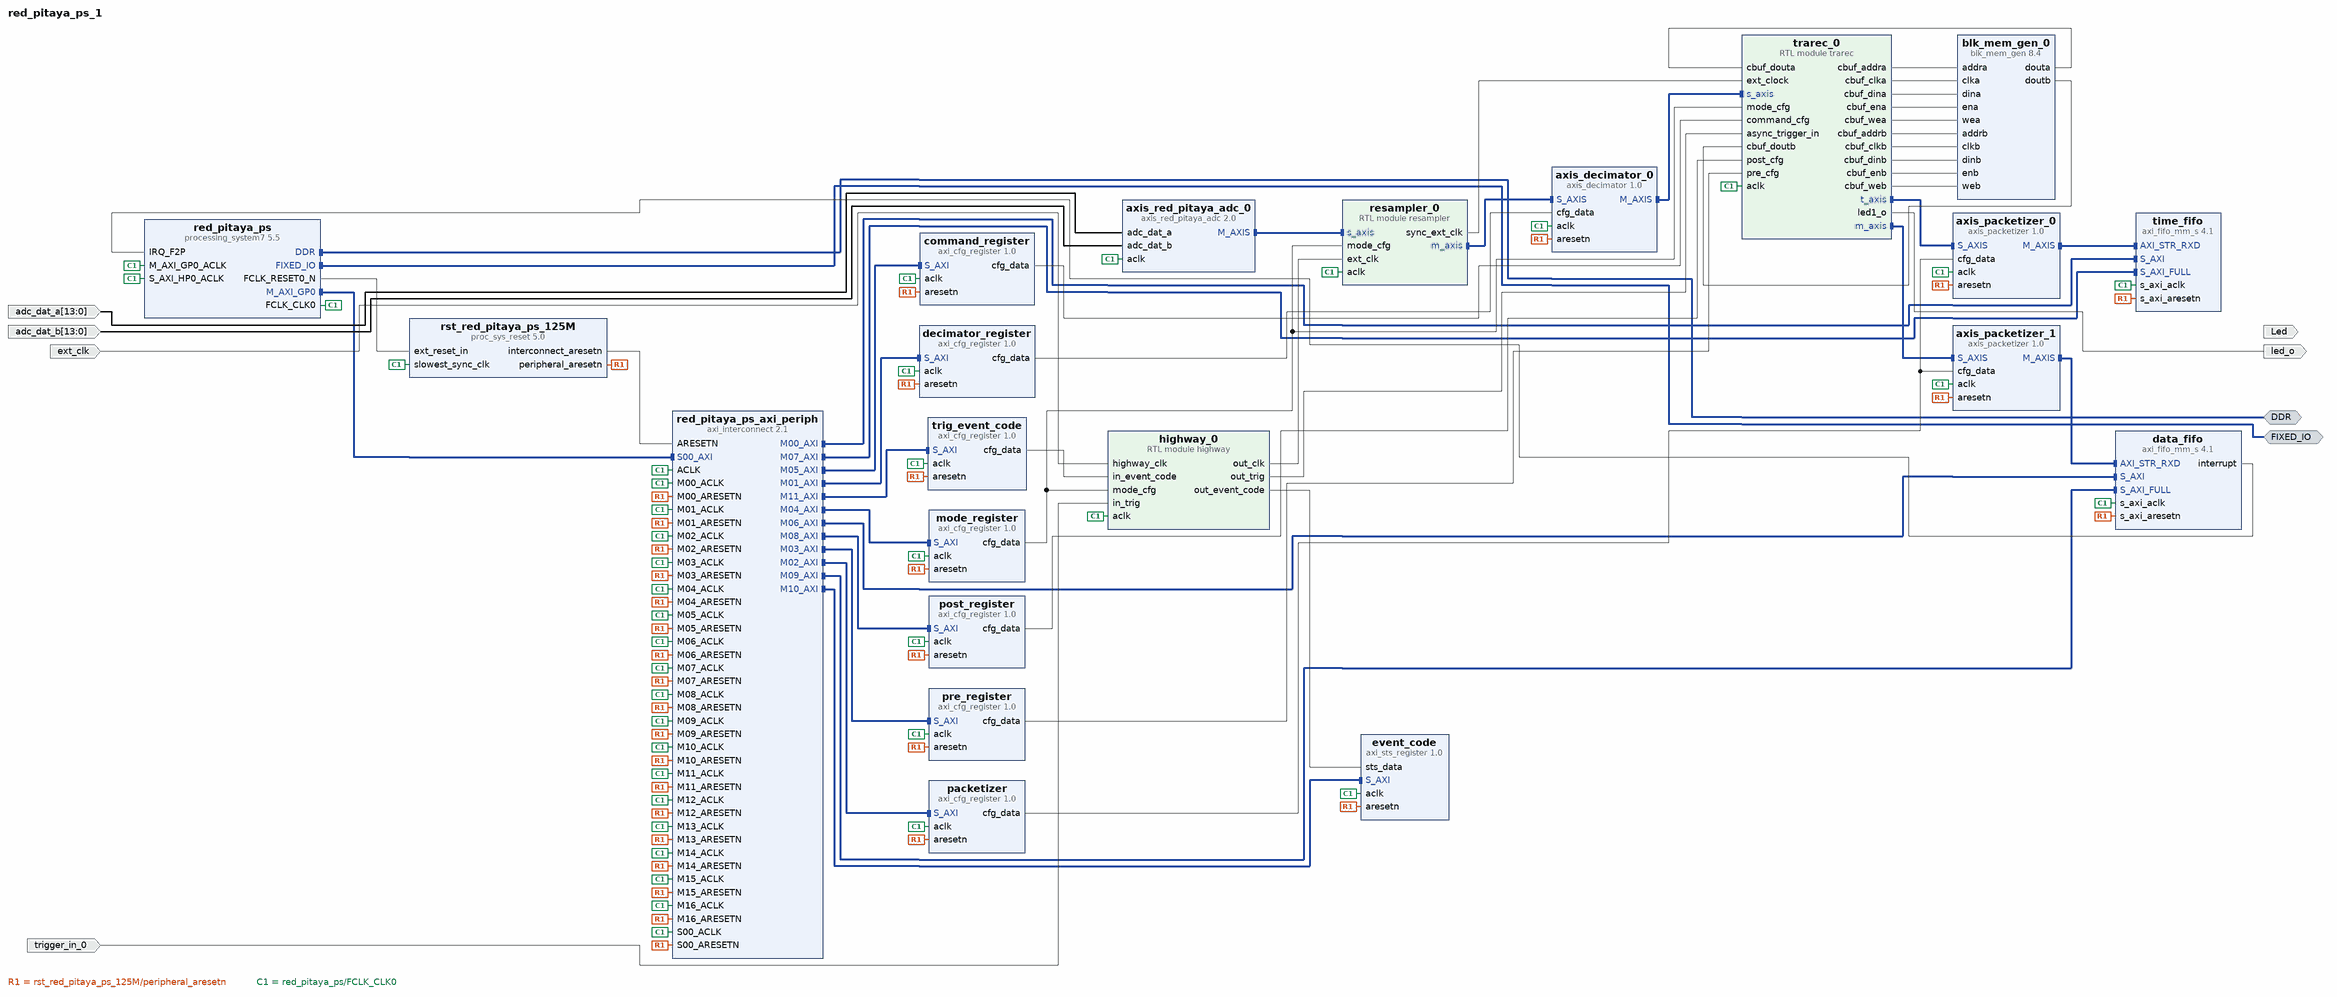
[diagram p0: block diagram of the top level]
# Vivado block design red_pitaya_ps_1, xc7z010clg400-1, Vivado 2017.4
create_bd_design red_pitaya_ps_1

create_bd_intf_port -mode Master -vlnv xilinx.com:interface:ddrx_rtl:1.0 DDR
create_bd_intf_port -mode Master -vlnv xilinx.com:display_processing_system7:fixedio_rtl:1.0 FIXED_IO
create_bd_port -dir I -from 13 -to 0 adc_dat_a
create_bd_port -dir I -from 13 -to 0 adc_dat_b
create_bd_port -dir O led_o
create_bd_port -dir O Led
create_bd_port -dir I -type clk ext_clk
set_property -dict {CONFIG.FREQ_HZ 125000000} [get_bd_ports ext_clk]
create_bd_port -dir I trigger_in_0

create_bd_cell -type ip -vlnv xilinx.com:ip:processing_system7:5.5 red_pitaya_ps
set_property -dict [list \
  CONFIG.PCW_QSPI_PERIPHERAL_FREQMHZ 125 \
  CONFIG.PCW_SDIO_PERIPHERAL_FREQMHZ 100 \
  CONFIG.PCW_UART_PERIPHERAL_FREQMHZ 100 \
  CONFIG.PCW_I2C_PERIPHERAL_FREQMHZ 111.111115 \
  CONFIG.PCW_FPGA0_PERIPHERAL_FREQMHZ 125 \
  CONFIG.PCW_FPGA1_PERIPHERAL_FREQMHZ 250 \
  CONFIG.PCW_FPGA3_PERIPHERAL_FREQMHZ 200 \
  CONFIG.PCW_USE_S_AXI_HP0 1 \
  CONFIG.PCW_USE_FABRIC_INTERRUPT 1 \
  CONFIG.PCW_S_AXI_HP0_DATA_WIDTH 32 \
  CONFIG.PCW_IRQ_F2P_INTR 1 \
  CONFIG.PCW_PRESET_BANK1_VOLTAGE {LVCMOS 2.5V} \
  CONFIG.PCW_UIPARAM_DDR_BUS_WIDTH {16 Bit} \
  CONFIG.PCW_UIPARAM_DDR_PARTNO {MT41J256M16 RE-125} \
  CONFIG.PCW_QSPI_PERIPHERAL_ENABLE 1 \
  CONFIG.PCW_QSPI_QSPI_IO {MIO 1 .. 6} \
  CONFIG.PCW_QSPI_GRP_SINGLE_SS_ENABLE 1 \
  CONFIG.PCW_QSPI_GRP_SINGLE_SS_IO {MIO 1 .. 6} \
  CONFIG.PCW_SINGLE_QSPI_DATA_MODE x4 \
  CONFIG.PCW_ENET0_PERIPHERAL_ENABLE 1 \
  CONFIG.PCW_ENET0_ENET0_IO {MIO 16 .. 27} \
  CONFIG.PCW_ENET0_GRP_MDIO_ENABLE 1 \
  CONFIG.PCW_ENET0_GRP_MDIO_IO {MIO 52 .. 53} \
  CONFIG.PCW_ENET_RESET_ENABLE 1 \
  CONFIG.PCW_ENET_RESET_SELECT {Share reset pin} \
  CONFIG.PCW_ENET0_RESET_ENABLE 0 \
  CONFIG.PCW_SD0_PERIPHERAL_ENABLE 1 \
  CONFIG.PCW_SD0_SD0_IO {MIO 40 .. 45} \
  CONFIG.PCW_SD0_GRP_CD_ENABLE 1 \
  CONFIG.PCW_SD0_GRP_CD_IO {MIO 46} \
  CONFIG.PCW_SD0_GRP_WP_ENABLE 1 \
  CONFIG.PCW_SD0_GRP_WP_IO {MIO 47} \
  CONFIG.PCW_UART0_PERIPHERAL_ENABLE 1 \
  CONFIG.PCW_UART0_UART0_IO {MIO 14 .. 15} \
  CONFIG.PCW_UART1_PERIPHERAL_ENABLE 1 \
  CONFIG.PCW_UART1_UART1_IO {MIO 8 .. 9} \
  CONFIG.PCW_SPI1_PERIPHERAL_ENABLE 1 \
  CONFIG.PCW_SPI1_SPI1_IO {MIO 10 .. 15} \
  CONFIG.PCW_USB0_PERIPHERAL_ENABLE 1 \
  CONFIG.PCW_USB0_USB0_IO {MIO 28 .. 39} \
  CONFIG.PCW_USB_RESET_ENABLE 1 \
  CONFIG.PCW_USB_RESET_SELECT {Share reset pin} \
  CONFIG.PCW_USB0_RESET_ENABLE 1 \
  CONFIG.PCW_USB0_RESET_IO {MIO 48} \
  CONFIG.PCW_I2C0_PERIPHERAL_ENABLE 1 \
  CONFIG.PCW_I2C0_I2C0_IO {MIO 50 .. 51} \
  CONFIG.PCW_I2C0_GRP_INT_ENABLE 0 \
  CONFIG.PCW_I2C_RESET_ENABLE 1 \
  CONFIG.PCW_I2C_RESET_SELECT {Share reset pin} \
  CONFIG.PCW_GPIO_MIO_GPIO_ENABLE 1 \
  CONFIG.PCW_GPIO_MIO_GPIO_IO MIO \
] [get_bd_cells red_pitaya_ps]
# 218 more settings of red_pitaya_ps are not shown: defaults, MIO pin electricals, DDR timing, and values the tool derives
create_bd_cell -type ip -vlnv xilinx.com:ip:axi_interconnect:2.1 red_pitaya_ps_axi_periph
set_property -dict {CONFIG.NUM_MI 17} [get_bd_cells red_pitaya_ps_axi_periph]
create_bd_cell -type ip -vlnv pavel-demin:user:axis_red_pitaya_adc:2.0 axis_red_pitaya_adc_0
create_bd_cell -type ip -vlnv pavel-demin:user:axis_decimator:1.0 axis_decimator_0
create_bd_cell -type ip -vlnv xilinx.com:ip:blk_mem_gen:8.4 blk_mem_gen_0
set_property -dict [list \
  CONFIG.Memory_Type True_Dual_Port_RAM \
  CONFIG.Enable_32bit_Address false \
  CONFIG.Use_Byte_Write_Enable false \
  CONFIG.Algorithm Minimum_Area \
  CONFIG.Assume_Synchronous_Clk false \
  CONFIG.Write_Width_A 32 \
  CONFIG.Write_Depth_A 16384 \
  CONFIG.Read_Width_A 32 \
  CONFIG.Write_Width_B 32 \
  CONFIG.Read_Width_B 32 \
  CONFIG.Enable_B Use_ENB_Pin \
  CONFIG.Register_PortA_Output_of_Memory_Primitives true \
  CONFIG.Register_PortB_Output_of_Memory_Primitives true \
  CONFIG.Use_RSTA_Pin false \
  CONFIG.Use_RSTB_Pin false \
  CONFIG.Port_B_Clock 100 \
  CONFIG.Port_B_Write_Rate 50 \
  CONFIG.Port_B_Enable_Rate 100 \
  CONFIG.Disable_Collision_Warnings false \
  CONFIG.use_bram_block Stand_Alone \
] [get_bd_cells blk_mem_gen_0]
create_bd_cell -type ip -vlnv pavel-demin:user:axi_cfg_register:1.0 decimator_register
set_property -dict {CONFIG.CFG_DATA_WIDTH 32} [get_bd_cells decimator_register]
create_bd_cell -type ip -vlnv pavel-demin:user:axis_packetizer:1.0 axis_packetizer_0
set_property -dict {CONFIG.CONTINUOUS TRUE} [get_bd_cells axis_packetizer_0]
create_bd_cell -type ip -vlnv pavel-demin:user:axi_cfg_register:1.0 packetizer
set_property -dict {CONFIG.CFG_DATA_WIDTH 32} [get_bd_cells packetizer]
create_bd_cell -type ip -vlnv pavel-demin:user:axi_cfg_register:1.0 pre_register
set_property -dict {CONFIG.CFG_DATA_WIDTH 32} [get_bd_cells pre_register]
create_bd_cell -type ip -vlnv pavel-demin:user:axi_cfg_register:1.0 mode_register
set_property -dict {CONFIG.CFG_DATA_WIDTH 32} [get_bd_cells mode_register]
create_bd_cell -type ip -vlnv pavel-demin:user:axi_cfg_register:1.0 command_register
set_property -dict {CONFIG.CFG_DATA_WIDTH 32} [get_bd_cells command_register]
create_bd_cell -type ip -vlnv xilinx.com:ip:axi_fifo_mm_s:4.1 time_fifo
set_property -dict [list \
  CONFIG.C_DATA_INTERFACE_TYPE 1 \
  CONFIG.C_USE_TX_DATA 0 \
  CONFIG.C_USE_RX_DATA 1 \
  CONFIG.C_USE_TX_CTRL 0 \
] [get_bd_cells time_fifo]
create_bd_cell -type ip -vlnv xilinx.com:ip:proc_sys_reset:5.0 rst_red_pitaya_ps_125M
create_bd_cell -type ip -vlnv pavel-demin:user:axi_cfg_register:1.0 post_register
set_property -dict {CONFIG.CFG_DATA_WIDTH 32} [get_bd_cells post_register]
create_bd_cell -type ip -vlnv xilinx.com:ip:axi_fifo_mm_s:4.1 data_fifo
set_property -dict [list \
  CONFIG.C_DATA_INTERFACE_TYPE 1 \
  CONFIG.C_RX_FIFO_PE_THRESHOLD 2 \
  CONFIG.C_RX_FIFO_PF_THRESHOLD 507 \
  CONFIG.C_RX_FIFO_DEPTH 32768 \
  CONFIG.C_S_AXI4_DATA_WIDTH 32 \
  CONFIG.C_AXIS_TUSER_WIDTH 4 \
  CONFIG.C_USE_TX_DATA 0 \
  CONFIG.C_USE_RX_DATA 1 \
  CONFIG.C_USE_TX_CTRL 0 \
] [get_bd_cells data_fifo]
create_bd_cell -type ip -vlnv pavel-demin:user:axis_packetizer:1.0 axis_packetizer_1
set_property -dict {CONFIG.CONTINUOUS TRUE} [get_bd_cells axis_packetizer_1]
create_bd_cell -type ip -vlnv pavel-demin:user:axi_sts_register:1.0 event_code
set_property -dict {CONFIG.STS_DATA_WIDTH 32} [get_bd_cells event_code]
create_bd_cell -type module -reference resampler resampler_0
create_bd_cell -type ip -vlnv pavel-demin:user:axi_cfg_register:1.0 trig_event_code
create_bd_cell -type module -reference trarec trarec_0
create_bd_cell -type module -reference highway highway_0

# ---- connections ----

connect_bd_intf_net [get_bd_intf_pins red_pitaya_ps/M_AXI_GP0] [get_bd_intf_pins red_pitaya_ps_axi_periph/S00_AXI]
connect_bd_intf_net [get_bd_intf_pins red_pitaya_ps_axi_periph/M01_AXI] [get_bd_intf_pins decimator_register/S_AXI]
connect_bd_intf_net [get_bd_intf_pins red_pitaya_ps_axi_periph/M02_AXI] [get_bd_intf_pins packetizer/S_AXI]
connect_bd_intf_net [get_bd_intf_pins red_pitaya_ps_axi_periph/M03_AXI] [get_bd_intf_pins pre_register/S_AXI]
connect_bd_intf_net [get_bd_intf_pins red_pitaya_ps_axi_periph/M04_AXI] [get_bd_intf_pins mode_register/S_AXI]
connect_bd_intf_net [get_bd_intf_pins red_pitaya_ps_axi_periph/M05_AXI] [get_bd_intf_pins command_register/S_AXI]
connect_bd_intf_net [get_bd_intf_pins red_pitaya_ps_axi_periph/M00_AXI] [get_bd_intf_pins time_fifo/S_AXI]
connect_bd_intf_net [get_bd_intf_pins axis_packetizer_0/M_AXIS] [get_bd_intf_pins time_fifo/AXI_STR_RXD]
connect_bd_intf_net [get_bd_intf_pins red_pitaya_ps_axi_periph/M07_AXI] [get_bd_intf_pins time_fifo/S_AXI_FULL]
connect_bd_intf_net [get_bd_intf_pins trarec_0/t_axis] [get_bd_intf_pins axis_packetizer_0/S_AXIS]
connect_bd_intf_net [get_bd_intf_pins resampler_0/s_axis] [get_bd_intf_pins axis_red_pitaya_adc_0/M_AXIS]
connect_bd_intf_net [get_bd_intf_pins resampler_0/m_axis] [get_bd_intf_pins axis_decimator_0/S_AXIS]
connect_bd_intf_net [get_bd_intf_pins red_pitaya_ps_axi_periph/M08_AXI] [get_bd_intf_pins post_register/S_AXI]
connect_bd_intf_net [get_bd_intf_pins red_pitaya_ps_axi_periph/M06_AXI] [get_bd_intf_pins data_fifo/S_AXI]
connect_bd_intf_net [get_bd_intf_pins red_pitaya_ps_axi_periph/M09_AXI] [get_bd_intf_pins data_fifo/S_AXI_FULL]
connect_bd_intf_net [get_bd_intf_pins trarec_0/m_axis] [get_bd_intf_pins axis_packetizer_1/S_AXIS]
connect_bd_intf_net [get_bd_intf_pins axis_packetizer_1/M_AXIS] [get_bd_intf_pins data_fifo/AXI_STR_RXD]
connect_bd_intf_net [get_bd_intf_pins axis_decimator_0/M_AXIS] [get_bd_intf_pins trarec_0/s_axis]
connect_bd_intf_net [get_bd_intf_pins red_pitaya_ps_axi_periph/M10_AXI] [get_bd_intf_pins event_code/S_AXI]
connect_bd_intf_net [get_bd_intf_pins red_pitaya_ps_axi_periph/M11_AXI] [get_bd_intf_pins trig_event_code/S_AXI]
connect_bd_intf_net [get_bd_intf_ports DDR] [get_bd_intf_pins red_pitaya_ps/DDR]
connect_bd_intf_net [get_bd_intf_ports FIXED_IO] [get_bd_intf_pins red_pitaya_ps/FIXED_IO]
connect_bd_net [get_bd_pins rst_red_pitaya_ps_125M/peripheral_aresetn] \
  [get_bd_pins axis_decimator_0/aresetn] [get_bd_pins decimator_register/aresetn] [get_bd_pins axis_packetizer_0/aresetn] \
  [get_bd_pins packetizer/aresetn] [get_bd_pins mode_register/aresetn] [get_bd_pins command_register/aresetn] \
  [get_bd_pins time_fifo/s_axi_aresetn] [get_bd_pins pre_register/aresetn] [get_bd_pins post_register/aresetn] \
  [get_bd_pins data_fifo/s_axi_aresetn] [get_bd_pins axis_packetizer_1/aresetn] [get_bd_pins event_code/aresetn] \
  [get_bd_pins trig_event_code/aresetn] [get_bd_pins red_pitaya_ps_axi_periph/S00_ARESETN] \
  [get_bd_pins red_pitaya_ps_axi_periph/M00_ARESETN] [get_bd_pins red_pitaya_ps_axi_periph/M01_ARESETN] \
  [get_bd_pins red_pitaya_ps_axi_periph/M02_ARESETN] [get_bd_pins red_pitaya_ps_axi_periph/M03_ARESETN] \
  [get_bd_pins red_pitaya_ps_axi_periph/M04_ARESETN] [get_bd_pins red_pitaya_ps_axi_periph/M05_ARESETN] \
  [get_bd_pins red_pitaya_ps_axi_periph/M06_ARESETN] [get_bd_pins red_pitaya_ps_axi_periph/M07_ARESETN] \
  [get_bd_pins red_pitaya_ps_axi_periph/M08_ARESETN] [get_bd_pins red_pitaya_ps_axi_periph/M09_ARESETN] \
  [get_bd_pins red_pitaya_ps_axi_periph/M10_ARESETN] [get_bd_pins red_pitaya_ps_axi_periph/M11_ARESETN] \
  [get_bd_pins red_pitaya_ps_axi_periph/M12_ARESETN] [get_bd_pins red_pitaya_ps_axi_periph/M13_ARESETN] \
  [get_bd_pins red_pitaya_ps_axi_periph/M14_ARESETN] [get_bd_pins red_pitaya_ps_axi_periph/M15_ARESETN] \
  [get_bd_pins red_pitaya_ps_axi_periph/M16_ARESETN]
connect_bd_net -net adc_dat_a_0_1 [get_bd_ports adc_dat_a] [get_bd_pins axis_red_pitaya_adc_0/adc_dat_a]
connect_bd_net -net adc_dat_b_0_1 [get_bd_ports adc_dat_b] [get_bd_pins axis_red_pitaya_adc_0/adc_dat_b]
connect_bd_net -net decimator_cfg_data [get_bd_pins decimator_register/cfg_data] [get_bd_pins axis_decimator_0/cfg_data]
connect_bd_net [get_bd_pins packetizer/cfg_data] [get_bd_pins axis_packetizer_0/cfg_data] [get_bd_pins axis_packetizer_1/cfg_data]
connect_bd_net [get_bd_pins trarec_0/cbuf_addra] [get_bd_pins blk_mem_gen_0/addra]
connect_bd_net [get_bd_pins trarec_0/cbuf_clka] [get_bd_pins blk_mem_gen_0/clka]
connect_bd_net [get_bd_pins trarec_0/cbuf_dina] [get_bd_pins blk_mem_gen_0/dina]
connect_bd_net [get_bd_pins trarec_0/cbuf_ena] [get_bd_pins blk_mem_gen_0/ena]
connect_bd_net [get_bd_pins trarec_0/cbuf_wea] [get_bd_pins blk_mem_gen_0/wea]
connect_bd_net [get_bd_pins trarec_0/cbuf_addrb] [get_bd_pins blk_mem_gen_0/addrb]
connect_bd_net [get_bd_pins trarec_0/cbuf_clkb] [get_bd_pins blk_mem_gen_0/clkb]
connect_bd_net [get_bd_pins trarec_0/cbuf_dinb] [get_bd_pins blk_mem_gen_0/dinb]
connect_bd_net [get_bd_pins trarec_0/cbuf_enb] [get_bd_pins blk_mem_gen_0/enb]
connect_bd_net [get_bd_pins trarec_0/cbuf_web] [get_bd_pins blk_mem_gen_0/web]
connect_bd_net [get_bd_pins blk_mem_gen_0/douta] [get_bd_pins trarec_0/cbuf_douta]
connect_bd_net [get_bd_pins blk_mem_gen_0/doutb] [get_bd_pins trarec_0/cbuf_doutb]
connect_bd_net -net pre_post_register_cfg_data [get_bd_pins pre_register/cfg_data] [get_bd_pins trarec_0/pre_cfg]
connect_bd_net -net axi_cfg_register_0_cfg_data [get_bd_pins mode_register/cfg_data] \
  [get_bd_pins resampler_0/mode_cfg] [get_bd_pins trarec_0/mode_cfg] [get_bd_pins highway_0/mode_cfg]
connect_bd_net [get_bd_pins command_register/cfg_data] [get_bd_pins trarec_0/command_cfg]
connect_bd_net [get_bd_pins trarec_0/led1_o] [get_bd_ports led_o]
connect_bd_net [get_bd_pins resampler_0/sync_ext_clk] [get_bd_pins trarec_0/ext_clock]
connect_bd_net [get_bd_pins rst_red_pitaya_ps_125M/interconnect_aresetn] [get_bd_pins red_pitaya_ps_axi_periph/ARESETN]
connect_bd_net [get_bd_pins red_pitaya_ps/FCLK_RESET0_N] [get_bd_pins rst_red_pitaya_ps_125M/ext_reset_in]
connect_bd_net [get_bd_pins post_register/cfg_data] [get_bd_pins trarec_0/post_cfg]
# net trarec_0_out_synch_trig has one end: Led
connect_bd_net [get_bd_pins data_fifo/interrupt] [get_bd_pins red_pitaya_ps/IRQ_F2P]
connect_bd_net [get_bd_pins red_pitaya_ps/FCLK_CLK0] \
  [get_bd_pins red_pitaya_ps/M_AXI_GP0_ACLK] [get_bd_pins red_pitaya_ps/S_AXI_HP0_ACLK] [get_bd_pins time_fifo/s_axi_aclk] \
  [get_bd_pins decimator_register/aclk] [get_bd_pins packetizer/aclk] [get_bd_pins pre_register/aclk] \
  [get_bd_pins mode_register/aclk] [get_bd_pins command_register/aclk] [get_bd_pins axis_red_pitaya_adc_0/aclk] \
  [get_bd_pins axis_decimator_0/aclk] [get_bd_pins axis_packetizer_0/aclk] \
  [get_bd_pins rst_red_pitaya_ps_125M/slowest_sync_clk] [get_bd_pins post_register/aclk] [get_bd_pins data_fifo/s_axi_aclk] \
  [get_bd_pins axis_packetizer_1/aclk] [get_bd_pins event_code/aclk] [get_bd_pins resampler_0/aclk] \
  [get_bd_pins trig_event_code/aclk] [get_bd_pins trarec_0/aclk] [get_bd_pins highway_0/aclk] \
  [get_bd_pins red_pitaya_ps_axi_periph/S00_ACLK] [get_bd_pins red_pitaya_ps_axi_periph/ACLK] \
  [get_bd_pins red_pitaya_ps_axi_periph/M00_ACLK] [get_bd_pins red_pitaya_ps_axi_periph/M01_ACLK] \
  [get_bd_pins red_pitaya_ps_axi_periph/M02_ACLK] [get_bd_pins red_pitaya_ps_axi_periph/M03_ACLK] \
  [get_bd_pins red_pitaya_ps_axi_periph/M04_ACLK] [get_bd_pins red_pitaya_ps_axi_periph/M05_ACLK] \
  [get_bd_pins red_pitaya_ps_axi_periph/M06_ACLK] [get_bd_pins red_pitaya_ps_axi_periph/M07_ACLK] \
  [get_bd_pins red_pitaya_ps_axi_periph/M08_ACLK] [get_bd_pins red_pitaya_ps_axi_periph/M09_ACLK] \
  [get_bd_pins red_pitaya_ps_axi_periph/M10_ACLK] [get_bd_pins red_pitaya_ps_axi_periph/M11_ACLK] \
  [get_bd_pins red_pitaya_ps_axi_periph/M12_ACLK] [get_bd_pins red_pitaya_ps_axi_periph/M13_ACLK] \
  [get_bd_pins red_pitaya_ps_axi_periph/M14_ACLK] [get_bd_pins red_pitaya_ps_axi_periph/M15_ACLK] \
  [get_bd_pins red_pitaya_ps_axi_periph/M16_ACLK]
connect_bd_net [get_bd_pins highway_0/out_event_code] [get_bd_pins event_code/sts_data]
connect_bd_net [get_bd_ports ext_clk] [get_bd_pins highway_0/highway_clk]
connect_bd_net [get_bd_pins highway_0/out_clk] [get_bd_pins resampler_0/ext_clk]
connect_bd_net [get_bd_pins highway_0/out_trig] [get_bd_pins trarec_0/async_trigger_in]
connect_bd_net -net trigger_in_0_1 [get_bd_ports trigger_in_0] [get_bd_pins highway_0/in_trig]
connect_bd_net [get_bd_pins trig_event_code/cfg_data] [get_bd_pins highway_0/in_event_code]

# ---- address map ----
assign_bd_address -offset 0x40420000 -range 64K -target_address_space [get_bd_addr_spaces red_pitaya_ps/Data] [get_bd_addr_segs time_fifo/S_AXI/Mem0]
assign_bd_address -offset 0x40430000 -range 64K -target_address_space [get_bd_addr_spaces red_pitaya_ps/Data] [get_bd_addr_segs time_fifo/S_AXI_FULL/Mem1]
assign_bd_address -offset 0x40440000 -range 64K -target_address_space [get_bd_addr_spaces red_pitaya_ps/Data] [get_bd_addr_segs data_fifo/S_AXI/Mem0]
assign_bd_address -offset 0x40450000 -range 64K -target_address_space [get_bd_addr_spaces red_pitaya_ps/Data] [get_bd_addr_segs data_fifo/S_AXI_FULL/Mem1]
assign_bd_address -offset 0x41000000 -range 64K -target_address_space [get_bd_addr_spaces red_pitaya_ps/Data] [get_bd_addr_segs post_register/s_axi/reg0]
assign_bd_address -offset 0x42000000 -range 64K -target_address_space [get_bd_addr_spaces red_pitaya_ps/Data] [get_bd_addr_segs command_register/s_axi/reg0]
assign_bd_address -offset 0x44000000 -range 64K -target_address_space [get_bd_addr_spaces red_pitaya_ps/Data] [get_bd_addr_segs mode_register/s_axi/reg0]
assign_bd_address -offset 0x48000000 -range 64K -target_address_space [get_bd_addr_spaces red_pitaya_ps/Data] [get_bd_addr_segs pre_register/s_axi/reg0]
assign_bd_address -offset 0x50000000 -range 64K -target_address_space [get_bd_addr_spaces red_pitaya_ps/Data] [get_bd_addr_segs packetizer/s_axi/reg0]
assign_bd_address -offset 0x58000000 -range 64K -target_address_space [get_bd_addr_spaces red_pitaya_ps/Data] [get_bd_addr_segs trig_event_code/s_axi/reg0]
assign_bd_address -offset 0x60000000 -range 64K -target_address_space [get_bd_addr_spaces red_pitaya_ps/Data] [get_bd_addr_segs decimator_register/s_axi/reg0]
assign_bd_address -offset 0x70000000 -range 64K -target_address_space [get_bd_addr_spaces red_pitaya_ps/Data] [get_bd_addr_segs event_code/s_axi/reg0]

validate_bd_design
save_bd_design
